# Altium schematic sheet Relay_MCU.SchDoc
size A4; SheetNumber: 1; SheetTotal: 3; SPICEModelCacheGVUYVZKY: <root> / <DocumentId>GVUYVZKY</DocumentId> / <CacheFrame Number="0"> / <Model Name="0805_150080rs75000" Kind="CKT"> / <Text>****** / .subckt 0805_150080RS75000  1  2 / D1 1 2 SMCW / .MODEL SMCW D / + IS=10.000E-21 / + N=1.6992 / + RS=1.0000E-6 / + IKF=1.2373E-3 / + CJO=1.0000E-12 / + M=.3333 / + VJ=.75 / + BV=5 / + IBV=10.00E-6 / + TT=5.0000E-9 / .ends</Text> / </Model> / </CacheFrame> / </root>
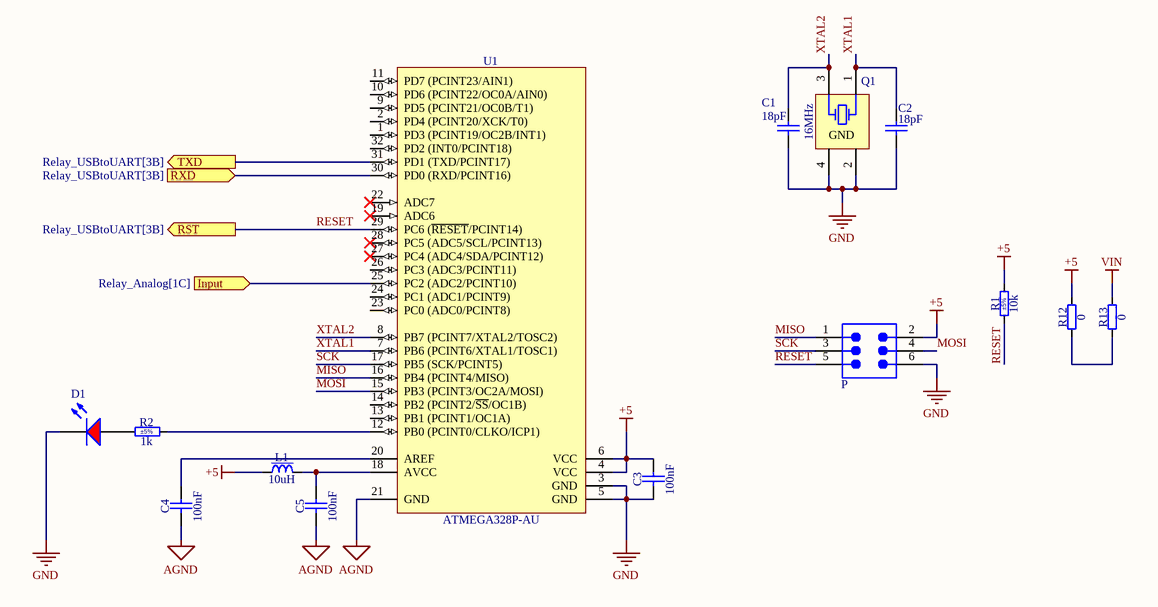
[diagram p0: Relay_MCU.SchDoc]

## Parts
C1  18pF  [CAPC2012X135N]
C2  18pF  [CAPC2012X135N]
C3  100nF  [CAPC2012X135N]
C4  100nF  [CAPC2012X135N]
C5  100nF  [CAPC2012X135N]
D1  Red, 2V, 140°  [WL-SMCW_0805_150080xx75000]  (value not drawn)
L1  10uH  [INDC2014X145N]
P  61300621121  [61300621121]  (value not drawn)
Q1  16MHz  [XTAL_EPSON_TSX-3225]
R1  10k  Tolerance: ±5%  [RESC2012X60N]
R2  1k  Tolerance: ±5%  [RESC2012X60N]
R12  0  [RESC2012X60N]
R13  0  [RESC2012X60N]
U1  ATMEGA328P-AU  [QFP80P900X900X120-32N]

## Ports
Input (in, see Relay_Analog[1C]), RST (out, see Relay_USBtoUART[3B]), RXD (in, see Relay_USBtoUART[3B]), TXD (out, see Relay_USBtoUART[3B])

## Nets
+5: C3.2 L1.1 P.2 R1.2 R12.2 U1.4(VCC) U1.6(VCC)
AGND: C4.1 C5.1 U1.21(GND)
GND: C1.1 C2.2 C3.1 D1.1(K) P.6 Q1.2(GND) Q1.4(GND) U1.3(GND) U1.5(GND)
VIN: R13.2
Input: U1.25(PC2_(ADC2/PCINT10)) ; port Input
MISO: P.1 U1.16(PB4_(PCINT4/MISO))
MOSI: P.4 U1.15(PB3_(PCINT3/OC2A/MOSI))
RESET: P.5 R1.1 U1.29(PC6_(~{RESET}/PCINT14)) ; port RST
RXD: U1.30(PD0_(RXD/PCINT16)) ; port RXD
SCK: P.3 U1.17(PB5_(SCK/PCINT5))
TXD: U1.31(PD1_(TXD/PCINT17)) ; port TXD
XTAL1: C2.1 Q1.1(X) U1.7(PB6_(PCINT6/XTAL1/TOSC1))
XTAL2: C1.2 Q1.3(X) U1.8(PB7_(PCINT7/XTAL2/TOSC2))
NetC4_2: C4.2 U1.20(AREF)
NetC5_2: C5.2 L1.2 U1.18(AVCC)
NetD1_2: D1.2(A) R2.1
NetR2_2: R2.2 U1.12(PB0_(PCINT0/CLKO/ICP1))
NetR12_1: R12.1 R13.1

Not connected (* = marked no-connect by the designer): U1 1(PD3_(PCINT19/OC2B/INT1)) 2(PD4_(PCINT20/XCK/T0)) 9(PD5_(PCINT21/OC0B/T1)) 10(PD6_(PCINT22/OC0A/AIN0)) 11(PD7_(PCINT23/AIN1)) 13(PB1_(PCINT1/OC1A)) 14(PB2_(PCINT2/~{SS}/OC1B)) 19(ADC6)* 22(ADC7)* 23(PC0_(ADC0/PCINT8)) 24(PC1_(ADC1/PCINT9)) 26(PC3_(ADC3/PCINT11)) 27(PC4_(ADC4/SDA/PCINT12))* 28(PC5_(ADC5/SCL/PCINT13))* 32(PD2_(INT0/PCINT18))

## Library data of the parts
C1 C2 = CC0805_18PF_50V_5%_NP0: Non-polarised capacitor; Part Description: SMD Multilayer Chip Ceramic Capacitor; Manufacturer: GENERIC; Manufacturer1 Part Number: 223886115189; Voltage: 50V; TC: C0G/NP0; Tolerance: ±5%; Part Number: CC0805_18PF_50V_5%_NP0; Component Kind: Standard; Component Type: Standard; Pin Count: 2; Value: 18pF; Status: Preferred; Manufacturer Part Number: CC0805_18PF_50V_5%_NP0; Case: 0805; Mounted: Yes; Socket: No; SMD: Yes; Sense: No; Manufacturer1 Example: PHYCOMP; Manufacturer1 ComponentHeight: 1.35mm; HelpURL: \\cern.ch\dfs\Applications\Altium\Datasheets\CC0805_NP0_PHYCOMP.pdf; Author: CERN DEM JLC; CreateDate: 3.12.2007; LatestRevisionDate: 3.12.2007
C3-C5 = CC0805_100NF_50V_10%_X7R: Non-polarised capacitor; Part Description: SMD Multilayer Chip Ceramic Capacitor; Manufacturer: GENERIC; Manufacturer1 Part Number: C2012X7R1H104K085; Voltage: 50V; TC: X7R; Tolerance: ±10%; Part Number: CC0805_100NF_50V_10%_X7R; Component Kind: Standard; Component Type: Standard; Pin Count: 2; Value: 100nF; Status: None; Manufacturer Part Number: CC0805_100NF_50V_10%_X7R; Case: 0805; Mounted: Yes; Socket: No; SMD: Yes; Sense: No; Manufacturer1 Example: TDK; Manufacturer1 ComponentHeight: 1mm; HelpURL: \\cern.ch\dfs\Applications\Altium\Datasheets\CC0805_X7R_TDK_C.pdf; Author: CERN DEM JLC; CreateDate: 3.12.2007; LatestRevisionDate: 22.04.2015
D1 = 150080RS75000: WL-SMCW Mono-color Chip LED Waterclear, size 0805, Red, 2V, 140°; Manufacturer: Wurth Elektronik; Case/Size Code: 0805; Chip Technology: AlInGaP; Dominant Wavelength: 625nm; Luminous Intensity: 150mcd; Peak Wavelength: 630nm; Manufacturer Part Number: 150080RS75000; Category: Signal LEDs; Match Code: WL-SMCW; ComponentLink1Description: Website Link; ComponentLink1URL: https://www.we-online.com/redexpert/article/150080RS75000?ad; ComponentLink2Description: Datasheet Link; ComponentLink2URL: https://www.we-online.com/redexpert/spec/150080RS75000?ad; Mount: Surface Mount; Operating Temperature Max: 85°C; Operating Temperature Min: -40°C; Packaging: Tape and Reel; Length: 2mm; Width: 1.25mm; Height: 0.7mm; Emitting Color: Red; Forward Voltage: 2V; Viewing Angle: 140°
L1 = IND0805_10NH_5%_EPCOS_B82498B: Inductor With Core; Part Number: IND0805_10UH_5%_EPCOS_B82498B; Part Description: SMT Inductor SIMID Series; Manufacturer: EPCOS; Manufacturer Part Number: B82498B3100J; Power: 700mA; Resistance: 0.03R; Tolerance: ±5%; Component Kind: Standard; Component Type: Standard; Pin Count: 2; Value: 10uH; Status: Preferred; Case: 0805; Mounted: Yes; Socket: No; SMD: Yes; Sense: No; ComponentHeight: 1.45mm; HelpURL: \\cern.ch\dfs\Applications\Altium\Datasheets\IND0805_EPCOS_B82498B.pdf; Author: CERN DEM JLC; CreateDate: 11.02.2008; LatestRevisionDate: 26.06.2008
P = 61300621121: WR-PHD Pin Header, THT, Vertical, pitch 2.54mm, 2 Row, 6P; Manufacturer: Wurth Elektronik; Contact Resistance: 20mOhm; Rated Current: 3A; Working Voltage: 250V; Withstanding Voltage: 500V; Manufacturer Part Number: 61300621121; Category: Board-to-Board Connectors; Match Code: WR-PHD; ComponentLink1Description: Website Link; ComponentLink1URL: https://www.we-online.com/redexpert/article/61300621121?ad; ComponentLink2Description: Datasheet Link; ComponentLink2URL: https://www.we-online.com/redexpert/spec/61300621121?ad; Mount: Through Hole; Operating Temperature Max: 105°C; Operating Temperature Min: -40°C; Packaging: Bag; Gender: Pin Header; Number of Pins: 6; Number of Rows: 2; Orientation: Vertical; Pitch: 2.54mm
Q1 = XTAL_40MHZ_EPSON_TSX-3225 40.0000MF10Z-B6: Crystal 4 pins 1=XTAL Control 2=GND3=XTAL 4=GND; Part Number: XTAL_16MHZ_EPSON_TSX-3225 40.0000MF10Z-B6; Part Description: Tolerance: ±10ppm,  Stability:±10ppm, -20°C to 75°C, 10pF, Surface Mount Quartz Crystal, TX-3225 Series; Manufacturer: EPSON; PressFit: No; Bonding: No; Component Kind: Standard; Component Type: Standard; PackageDescription: Crystal, Corner Concave; 4 Pin, 2.50mm L X 3.20mm W X 0.6mm H, TSX-3225 Serie; Value: 16MHz; Manufacturer Part Number: TSX-3225 40.0000MF10Z-B6; Pin Count: 4; Mounted: Yes; Socket: No; SMD: Yes; Sense: No; ComponentHeight: 0.6mm; HelpURL: \\cern.ch\dfs\Applications\Altium\Datasheets\XTAL_EPSON_TSX-3225.pdf; ComponentLink1URL: \\cern.ch\dfs\Applications\Altium\Datasheets\XTAL_EPSON_TSX-3225_Ordering-Informations.pdf; ComponentLink1Description: Ordering Informations; Author: CERN DEM HF; CreateDate: 24.10.2023; LatestRevisionDate: 24.10.2023
R1 = R0805_10K_1%_0.125W_100PPM: Resistor - 5%; Part Number: R0805_10K_5%_0.125W_100PPM; Part Description: General Purpose Thick Film Chip Resistor; Manufacturer: GENERIC; Manufacturer1 Part Number: NRC10F1002TRF; Power: 0.125W; TC: ±100ppm/°C; PressFit: No; Component Kind: Standard; Component Type: Standard; Pin Count: 2; Value: 10k; Status: Preferred; Manufacturer Part Number: R0805_10K_5%_0.125W_100PPM; Case: 0805; Mounted: Yes; Sense: No; Socket: No; SMD: Yes; Manufacturer1 Example: NIC COMPONENT; Manufacturer1 ComponentHeight: 0.6mm; HelpURL: \\cern.ch\dfs\Applications\Altium\Datasheets\R0805_NIC_NRC.pdf; Author: CERN DEM JLC; CreateDate: 3.12.2007; LatestRevisionDate: 13.03.2008
R2 = R0805_1K_1%_0.125W_100PPM: Resistor - 5%; Part Number: R0805_1K_5%_0.125W_100PPM; Part Description: General Purpose Thick Film Chip Resistor; Manufacturer: GENERIC; Manufacturer1 Part Number: NRC10F1001TRF; Power: 0.125W; TC: ±100ppm/°C; PressFit: No; Component Kind: Standard; Component Type: Standard; Pin Count: 2; Value: 1k; Status: Preferred; Manufacturer Part Number: R0805_1K_5%_0.125W_100PPM; Case: 0805; Mounted: Yes; Sense: No; Socket: No; SMD: Yes; Manufacturer1 Example: NIC COMPONENT; Manufacturer1 ComponentHeight: 0.6mm; HelpURL: \\cern.ch\dfs\Applications\Altium\Datasheets\R0805_NIC_NRC.pdf; Author: CERN DEM JLC; CreateDate: 3.12.2007; LatestRevisionDate: 13.03.2008
R12 R13 = R0805_0R_JUMPER: Resistor; Part Description: 2A (0.05R Max DC Resistance) Zero Ohm Jumper; Manufacturer: GENERIC; Manufacturer1 Part Number: NRC10Z0; PressFit: No; Part Number: R0805_0R_JUMPER; Component Kind: Standard; Component Type: Standard; Pin Count: 2; Value: 0; Status: Preferred; Manufacturer Part Number: R0805_0R_JUMPER; Case: 0805; Mounted: Yes; Sense: No; Socket: No; SMD: Yes; Manufacturer1 Example: NIC COMPONENT; Manufacturer1 ComponentHeight: 0.6mm; HelpURL: \\cern.ch\dfs\Applications\Altium\Datasheets\R0805_NIC_NRC.pdf; Author: CERN DEM JLC; CreateDate: 3.12.2007; LatestRevisionDate: 13.03.2008
U1 = ATMEGA328P-AU: 8-bit AVR Microcontroller, 32KB Flash, 1KB EEPROM, 2KB SRAM, 32-Pin TQFP; Part Description: 8-bit AVR Microcontroller, 32KB Flash, 1KB EEPROM, 2KB SRAM, 32-Pin TQFP, Industrial Grade (-40°C to 85°C); Manufacturer: ATMEL; PressFit: No; Bonding: No; Part Number: ATMEGA328P-AU; Component Kind: Standard; Component Type: Standard; Device: ATMEGA328P-AU; PackageDescription: QFP, 0.80mm Pitch, Square; 32 Pin, 7.00mm L X 7.00mm W X 1.20mm H body, IPC Medium Density; Manufacturer Part Number: ATMEGA328P-AU; Pin Count: 32; Case: QFP32; Mounted: Yes; Socket: No; SMD: Yes; Sense: No; ComponentHeight: 1.2mm; HelpURL: \\cern.ch\dfs\Applications\Altium\Datasheets\ATMEGA328P-AU.pdf; Author: CERN DEM JLC; CreateDate: 2.07.2014; LatestRevisionDate: 2.07.2014